# Altium schematic sheet can.SchDoc: CAN
size A; Organization: Cal Poly Racing; SheetNumber: 3; SheetTotal: 4; engineer1: Graydon Wilson
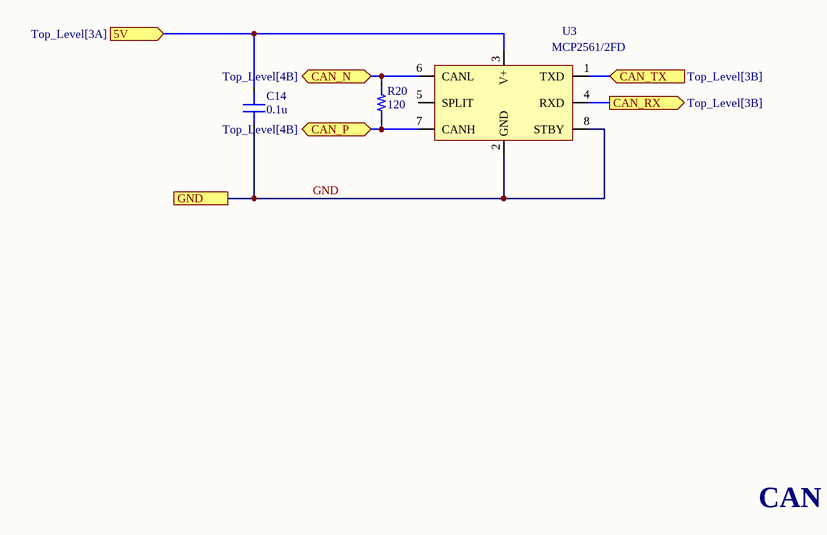
[diagram p0: can.SchDoc]

## Parts
C14  value 0.1u  [0603_CAP]  (hidden comment: Capacitor)
R20  value 120  [0603_RES]  (hidden comment: Resistor)
U3  MCP2561/2FD  [SOIC-8]

## Ports
5V (in, see Top_Level[3A]), CAN_N (bidir, see Top_Level[4B]), CAN_P (bidir, see Top_Level[4B]), CAN_RX (out, see Top_Level[3B]), CAN_TX (in, see Top_Level[3B]), GND

## Nets
5V: C14.1 U3.3(V+) ; port 5V
CAN_N: R20.2 U3.6(CANL) ; port CAN_N
CAN_P: R20.1 U3.7(CANH) ; port CAN_P
CAN_RX: U3.4(RXD) ; port CAN_RX
CAN_TX: U3.1(TXD) ; port CAN_TX
GND: C14.2 U3.2(GND) U3.8(STBY) ; port GND

Not connected (* = marked no-connect by the designer): U3 5(SPLIT)

## Notes on the sheet
- CAN
- Title
- Size:
- Date:
- A
- Number:
- Time:
- Revision:
- Sheet
- of
- File:

## Library data of the parts
U3 = MCP2561/2FD: 1/1 Transceiver CANbus; Vcc: 5; Name: MCP2561/2FD; Type: CAN; ComponentLink1Description: Digikey; ComponentLink1URL: https://www.digikey.com/product-detail/en/microchip-technology/MCP2561FDT-E-SN/MCP2561FDT-E-SNCT-ND/8637243; ComponentLink2Description: Datasheet; ComponentLink2URL: http://ww1.microchip.com/downloads/en/DeviceDoc/20005284A.pdf
R20 = Resistor: Tolerance: *